# EAGLE design Science-BoardR2 (EAGLE 7.4.0)
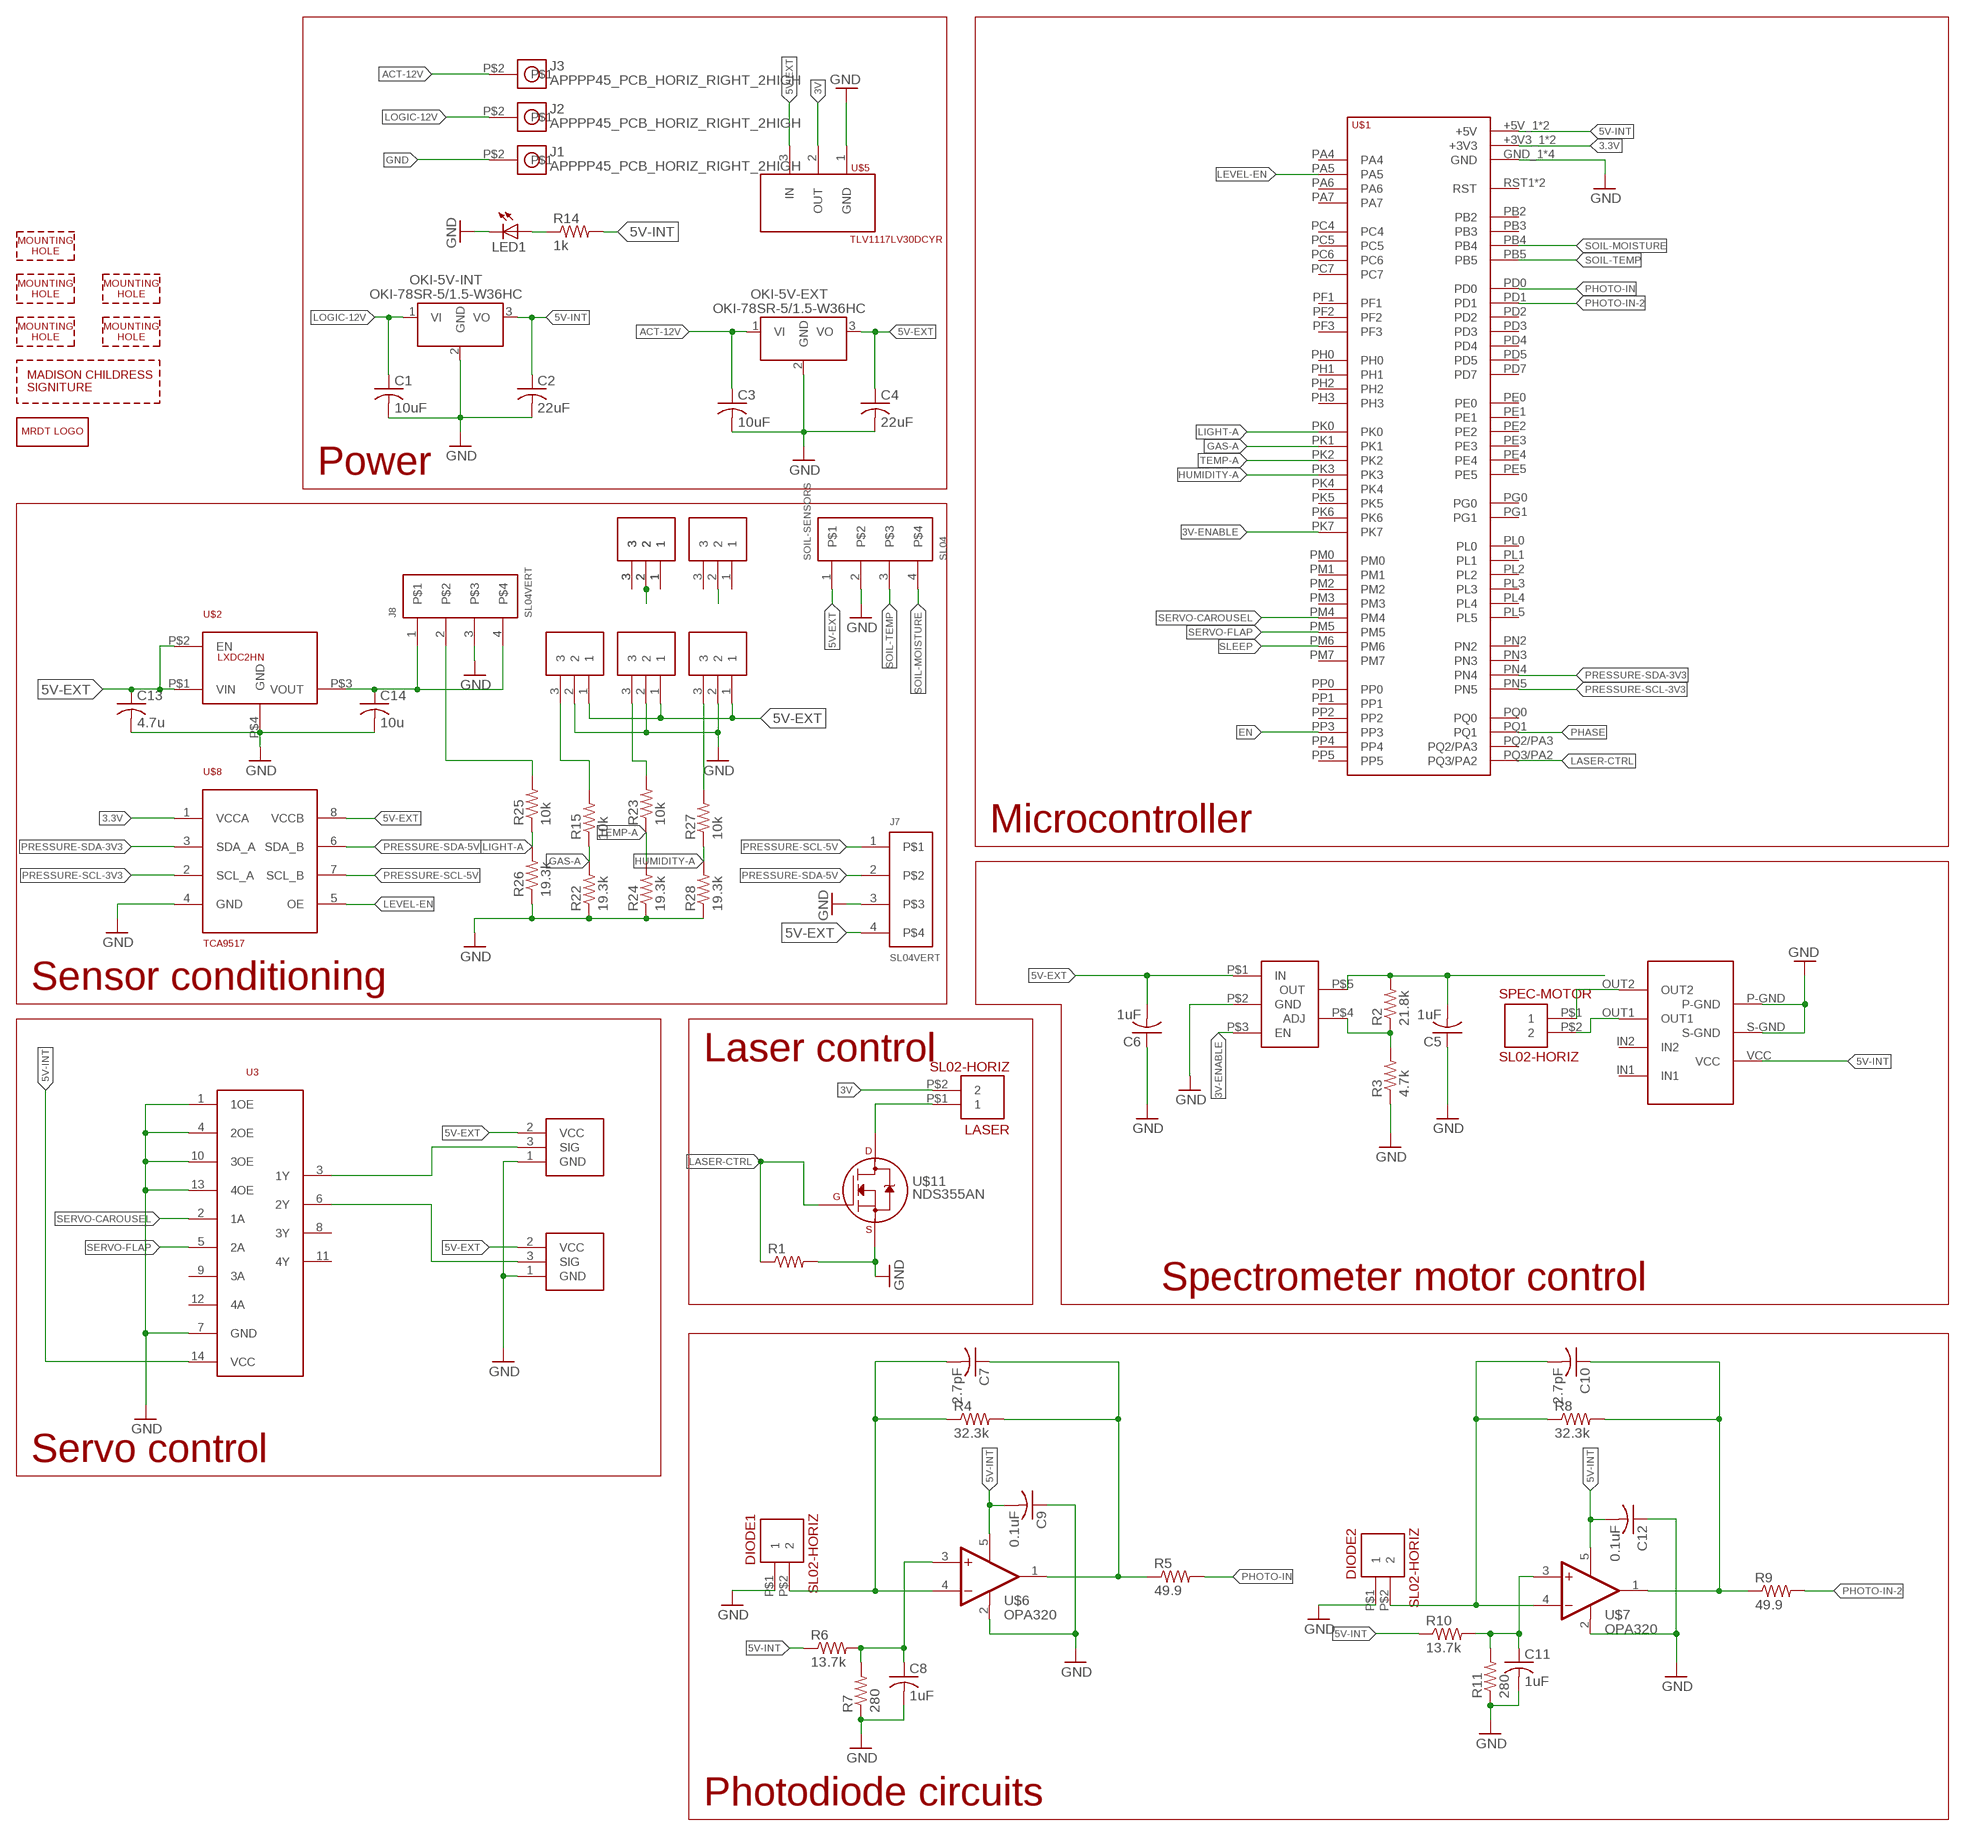
[diagram p0: schematic, sheet 1]

## Parts
C1  10uF  C-USC1206  [C1206]
C2  22uF  C-USC1206  [C1206]
C3  10uF  C-USC1206  [C1206]
C4  22uF  C-USC1206  [C1206]
C5  1uF  C-USC0805  [C0805]
C6  1uF  C-USC0805  [C0805]
C7  2.7pF  C-USC0805  [C0805]
C8  1uF  C-USC0805  [C0805]
C9  0.1uF  C-USC0805  [C0805]
C10  2.7pF  C-USC0805  [C0805]
C11  1uF  C-USC0805  [C0805]
C12  0.1uF  C-USC0805  [C0805]
C13  4.7u  C-USC0805  [C0805]
C14  10u  C-USC0805  [C0805]
CAROUSEL  SERVOMOLEX_SL_THRU_HOLE  [MOLEX_SL_03_TH]
DIODE1  SL02-HORIZ  [MOLEX-70551-0001]
DIODE2  SL02-HORIZ  [MOLEX-70551-0001]
FLAP  SERVOMOLEX_SL_THRU_HOLE  [MOLEX_SL_03_TH]
H1  MOUNTING_HOLE#6  [#6_SCREW]
H2  MOUNTING_HOLE#6  [#6_SCREW]
H3  MOUNTING_HOLE#6  [#6_SCREW]
H4  MOUNTING_HOLE#6  [#6_SCREW]
H5  MOUNTING_HOLE#6  [#6_SCREW]
J1  APPPP45_PCB_HORIZ_RIGHT_2HIGH  [APP45_PCB_HORIZ_RIGHT_2HIGH]
J2  APPPP45_PCB_HORIZ_RIGHT_2HIGH  [APP45_PCB_HORIZ_RIGHT_2HIGH]
J3  APPPP45_PCB_HORIZ_RIGHT_2HIGH  [APP45_PCB_HORIZ_RIGHT_2HIGH]
J4  SL03  [MOLEX-70543-0002]
J5  SL03  [MOLEX-70543-0002]
J6  SL03  [MOLEX-70543-0002]
J7  SL04VERT  [MOLEX-70543-0003]
J8  SL04VERT  [MOLEX-70543-0003]
J9  SL03  [MOLEX-70543-0002]
J10  SL03  [MOLEX-70543-0002]
J11  SL03  [MOLEX-70543-0002]
LASER  SL02-HORIZ  [MOLEX-70551-0001]
LED1  LEDCHIP-LED0805  [CHIP-LED0805]
LOGO1  MRDT_LOGO  [MRDT_LOGO]
OKI-5V-EXT  OKI-78SR-5/1.5-W36HC  [OKI-78SR_HORIZ]
OKI-5V-INT  OKI-78SR-5/1.5-W36HC  [OKI-78SR_HORIZ]
R1  R-US_M0805  [M0805]
R2  21.8k  R-US_M0805  [M0805]
R3  4.7k  R-US_M0805  [M0805]
R4  32.3k  R-US_M0805  [M0805]
R5  49.9  R-US_M0805  [M0805]
R6  13.7k  R-US_M0805  [M0805]
R7  280  R-US_M0805  [M0805]
R8  32.3k  R-US_M0805  [M0805]
R9  49.9  R-US_M0805  [M0805]
R10  13.7k  R-US_M0805  [M0805]
R11  280  R-US_M0805  [M0805]
R14  1k  R-US_M0805  [M0805]
R15  10k  R-US_R0805  [R0805]
R22  19.3k  R-US_R0805  [R0805]
R23  10k  R-US_R0805  [R0805]
R24  19.3k  R-US_R0805  [R0805]
R25  10k  R-US_R0805  [R0805]
R26  19.3k  R-US_R0805  [R0805]
R27  10k  R-US_R0805  [R0805]
R28  19.3k  R-US_R0805  [R0805]
SOIL-SENSORS  SL04  [MOLEX_SL_04_TH]
SPEC-MOTOR  SL02-HORIZ  [MOLEX-70551-0001]
U3  SN74AHCT125  [SOIC14]
U$1  TIVA-1294  [TIVA-C-CONNECTED]
U$2  LXDC2HN  [4-SMD]
U$3  AP7365-WG-7DICT-ND  [SOT-25]
U$5  TLV1117LV30DCYR  [TO-243AA]
U$6  OPA320  [SOT-23-5]
U$7  OPA320  [SOT-23-5]
U$8  TCA9517  [SOIC8]
U$9  MADISON-CHILDRESS  [MADISON-CHLDRESS-SIG]
U$10  LB1930MC  [SOIC10]
U$11  NDS355AN  [SOT-23]

## Nets
3.3V: U$1.+3V3_1(+3V3) U$1.+3V3_2(+3V3) U$8.1(VCCA)
3V: LASER.P$2 U$5.2(OUT)
3V-ENABLE: U$1.PK7 U$3.P$3(EN)
5V-EXT: C4.1 C6.2 C13.1 CAROUSEL.2(VCC) FLAP.2(VCC) J4.1 J5.1 J6.1 J7.4 OKI-5V-EXT.3(VO) SOIL-SENSORS.1 U$2.P$1(VIN) U$2.P$2(EN) U$3.P$1(IN) U$5.3(IN) U$8.8(VCCB)
5V-INT: C2.1 C9.2 C12.2 OKI-5V-INT.3(VO) R6.1 R10.1 R14.2 U3.14(VCC) U$1.+5V_1(+5V) U$1.+5V_2(+5V) U$6.5(OFF1) U$7.5(OFF1) U$10.VCC
ACT-12V: C3.1 J3.P$2 OKI-5V-EXT.1(VI)
EN: U$1.PP3
GAS-A: R15.1 R22.2 U$1.PK1
GND: C1.2 C2.2 C3.2 C4.2 C5.1 C6.1 C8.2 C9.1 C11.2 C12.1 C13.2 C14.2 CAROUSEL.1(GND) DIODE1.P$1 DIODE2.P$1 FLAP.1(GND) J1.P$2 J4.2 J5.2 J6.2 J7.3 J8.3 LED1.C OKI-5V-EXT.2(GND) OKI-5V-INT.2(GND) R1.2 R3.1 R7.1 R11.1 R22.1 R24.1 R26.1 R28.1 SOIL-SENSORS.2 U3.1(1OE) U3.4(2OE) U3.7(GND) U3.10(3OE) U3.13(4OE) U$1.GND_1(GND) U$1.GND_2(GND) U$1.GND_3(GND) U$1.GND_4(GND) U$2.P$4(GND) U$3.P$2(GND) U$5.1(GND) U$6.2(OFF2) U$7.2(OFF2) U$8.4(GND) U$10.P-GND U$10.S-GND U$11.2(S)
HUMIDITY-A: R27.1 R28.2 U$1.PK3
LASER-CTRL: R1.1 U$1.PQ3/PA2 U$11.1(G)
LEVEL-EN: U$1.PA5 U$8.5(OE)
LIGHT-A: R25.1 R26.2 U$1.PK0
LOGIC-12V: C1.1 J2.P$2 OKI-5V-INT.1(VI)
N$1: SPEC-MOTOR.P$1 U$10.OUT2
N$2: SPEC-MOTOR.P$2 U$10.OUT1
N$3: LASER.P$1 U$11.3(D)
N$4: C7.2 DIODE1.P$2 R4.1 U$6.4(-IN)
N$5: C5.2 R2.2 U$3.P$5(OUT)
N$6: J8.2 R25.2
N$7: J5.3 R23.2
N$8: C7.1 R4.2 R5.1 U$6.1(OUT)
N$9: C10.2 DIODE2.P$2 R8.1 U$7.4(-IN)
N$10: C8.1 R6.2 R7.2 U$6.3(+IN)
N$11: CAROUSEL.3(SIG) U3.3(1Y)
N$12: FLAP.3(SIG) U3.6(2Y)
N$13: C10.1 R8.2 R9.1 U$7.1(OUT)
N$14: C11.1 R10.2 R11.2 U$7.3(+IN)
N$16: J9.1 J11.1
N$17: J9.2 J11.2
N$18: R2.1 R3.2 U$3.P$4(ADJ)
N$19: J9.3 J11.3
N$20: LED1.A R14.1
N$21: J4.3 R15.2
N$22: J6.3 R27.2
N$23: J10.2
PHASE: U$1.PQ1
PHOTO-IN: R5.2 U$1.PD0
PHOTO-IN-2: R9.2 U$1.PD1
PRESSURE-SCL-3V3: U$1.PN5 U$8.2(SCL_A)
PRESSURE-SCL-5V: J7.1 U$8.7(SCL_B)
PRESSURE-SDA-3V3: U$1.PN4 U$8.3(SDA_A)
PRESSURE-SDA-5V: J7.2 U$8.6(SDA_B)
SERVO-CAROUSEL: U3.2(1A) U$1.PM4
SERVO-FLAP: U3.5(2A) U$1.PM5
SLEEP: U$1.PM6
SOIL-MOISTURE: SOIL-SENSORS.4 U$1.PB4
SOIL-TEMP: SOIL-SENSORS.3 U$1.PB5
TEMP-A: R23.1 R24.2 U$1.PK2
UV-3.3: C14.1 J8.1 J8.4 U$2.P$3(VOUT)
Unconnected: J10.1 J10.3 U3.8(3Y) U3.9(3A) U3.11(4Y) U3.12(4A) U$1.PA4 U$1.PA6 U$1.PA7 U$1.PB2 U$1.PB3 U$1.PC4 U$1.PC5 U$1.PC6 U$1.PC7 U$1.PD2 U$1.PD3 U$1.PD4 U$1.PD5 U$1.PD7 U$1.PE0 U$1.PE1 U$1.PE2 U$1.PE3 U$1.PE4 U$1.PE5 U$1.PF1 U$1.PF2 U$1.PF3 U$1.PG0 U$1.PG1 U$1.PH0 U$1.PH1 U$1.PH2 U$1.PH3 U$1.PK4 U$1.PK5 U$1.PK6 U$1.PL0 U$1.PL1 U$1.PL2 U$1.PL3 U$1.PL4 U$1.PL5 U$1.PM0 U$1.PM1 U$1.PM2 U$1.PM3 U$1.PM7 U$1.PN2 U$1.PN3 U$1.PP0 U$1.PP1 U$1.PP2 U$1.PP4 U$1.PP5 U$1.PQ0 U$1.PQ2/PA3 U$1.RST1(RST) U$1.RST_2(RST) U$10.IN1 U$10.IN2

## Notes on the sheet
- Power
- Microcontroller
- Sensor conditioning
- Laser control
- Spectrometer motor control
- Servo control
- Photodiode circuits

## Library data of the parts
C1-C14 = rcl:C-US: CAPACITOR, American symbol
CAROUSEL FLAP = MRDT-Connectors:SERVO; ORIENT: HORIZ; PARTNO: 0705550002
DIODE1 DIODE2 LASER SPEC-MOTOR = MRDT-Connectors:SL02
H1-H5 = MRDT-Hardware:MOUNTING_HOLE: Mounting hole for M6 bolt. Standard use mounting hole for: Tiva C Connected - M6 Anderson Powerpole Mounting Wing - M8 Most frame-mounted PCB's - M8
J1-J3 = MRDT-Connectors:APP: http://www.powerwerx.com/anderson-powerpoles/
J4-J6 J9-J11 = MRDT-Connectors:SL03: Molex 3-pin SL connector Locking 3 pin connector with standard header spacing. Backward compatible with standard RC servo connectors.
J7 J8 SOIL-SENSORS = MRDT-Connectors:SL04
LED1 = led:LED: LED OSRAM: - CHIPLED LG R971, LG N971, LY N971, LG Q971, LY Q971, LO R971, LY R971 LH N974, LH R974 LS Q976, LO Q976, LY Q976 LO Q996 - Hyper CHIPLED LW Q18S LB Q993, LB Q99A, LB R99A - SideLED LS A670, LO A670, LY A670, LG A670, LP A670 LB A673, LV A673, LT A673, LW A673 LH A674 LY A675 LS A676, LA A676, LO A676, LY A676, LW A676 LS A679, LY A679, LG A679 - Hyper Micro SIDELED® LS Y876, LA Y876, LO Y876, LY Y876 LT Y87S - SmartLED LW L88C, LW L88S LB L89C, LB L89S, LG L890 LS L89K, LO L89K, LY L89K LS L896, LA L896, LO L896, LY L896 - TOPLED LS T670, LO T670, LY T670, LG T670, LP T670 LSG T670, LSP T670, LSY T670, LOP T670, LYG T670 LG T671, LOG T671, LSG T671 LB T673, LV T673, LT T673, LW T673 LH T674 LS T676, LA T676, LO T676, LY T676, LB T676, LH T676, LSB T676, LW T676 LB T67C, LV T67C, LT T67C, LS T67K, LO T67K, LY T67K, LW E67C LS E67B, LA E67B, LO E67B, LY E67B, LB E67C, LV E67C, LT E67C LW T67C LS T679, LY T679, LG T679 LS T770, LO T770, LY T770, LG T770, LP T770 LB T773, LV T773, LT T773, LW T773 LH T774 LS E675, LA E675, LY E675, LS T675 LS T776, LA T776, LO T776, LY T776, LB T776 LHGB T686 LT T68C, LB T68C - Hyper Mini TOPLED® LB M676 - Mini TOPLED Santana® LG M470 LS M47K, LO M47K, LY M47K Source: http://www.osram.convergy.de LUXEON: - LUMILED® LXK2-PW12-R00, LXK2-PW12-S00, LXK2-PW14-U00, LXK2-PW14-V00 LXK2-PM12-R00, LXK2-PM12-S00, LXK2-PM14-U00 LXK2-PE12-Q00, LXK2-PE12-R00, LXK2-PE12-S00, LXK2-PE14-T00, LXK2-PE14-U00 LXK2-PB12-K00, LXK2-PB12-L00, LXK2-PB12-M00, LXK2-PB14-N00, LXK2-PB14-P00, LXK2-PB14-Q00 LXK2-PR12-L00, LXK2-PR12-M00, LXK2-PR14-Q00, LXK2-PR14-R00 LXK2-PD12-Q00, LXK2-PD12-R00, LXK2-PD12-S00 LXK2-PH12-R00, LXK2-PH12-S00 LXK2-PL12-P00, LXK2-PL12-Q00, LXK2-PL12-R00 Source: www.luxeon.com KINGBRIGHT: KA-3528ASYC Source: www.kingbright.com
LOGO1 = MRDT-Hardware:MRDT_LOGO
OKI-5V-EXT OKI-5V-INT = MRDT-ICs:OKI-78SR-*/1.5-W36?C: 4.95W DC/DC Converter Manufacturer: Murata; VOUT: +5v
R1-R11 R14 R15 R22-R28 = rcl:R-US_: RESISTOR, American symbol
U3 = MRDT-ICs:SN74AHCT125: part # SN74AHCT125 QUADRUPLE BUS BUFFER GATES WITH 3-STATE OUTPUTS http://www.digikey.com/product-detail/en/SN74AHCT125DR/296-4652-1-ND/405208; PARTNO: SN74AHCT125
U$1 = MRDT-Microcontrollers:TIVA-1294: TIVA C CONNECTED LAUNCHPAD
U$2 = MRDT-ICs:LXDC2HN
U$3 = MRDT-ICs:AP7365-WG-7DICT-ND: Linear Voltage Regulator IC Positive Adjustable 1 Output 0.8 V ~ 5 V 600mA SOT-25-5
U$5 = MRDT-ICs:TLV1117LV30DCYR: Linear Voltage Regulator IC Positive Fixed 1 Output 3V 1A SOT-223-4
U$6 U$7 = MRDT-ICs:OPA320
U$8 = MRDT-ICs:TCA9517: TCA9517 Level-Shifting I2C Bus Repeater
U$9 = sig:MADISON-CHILDRESS
U$10 = Custom:LB1930MC
U$11 = transistors:NDS355AN

## Board
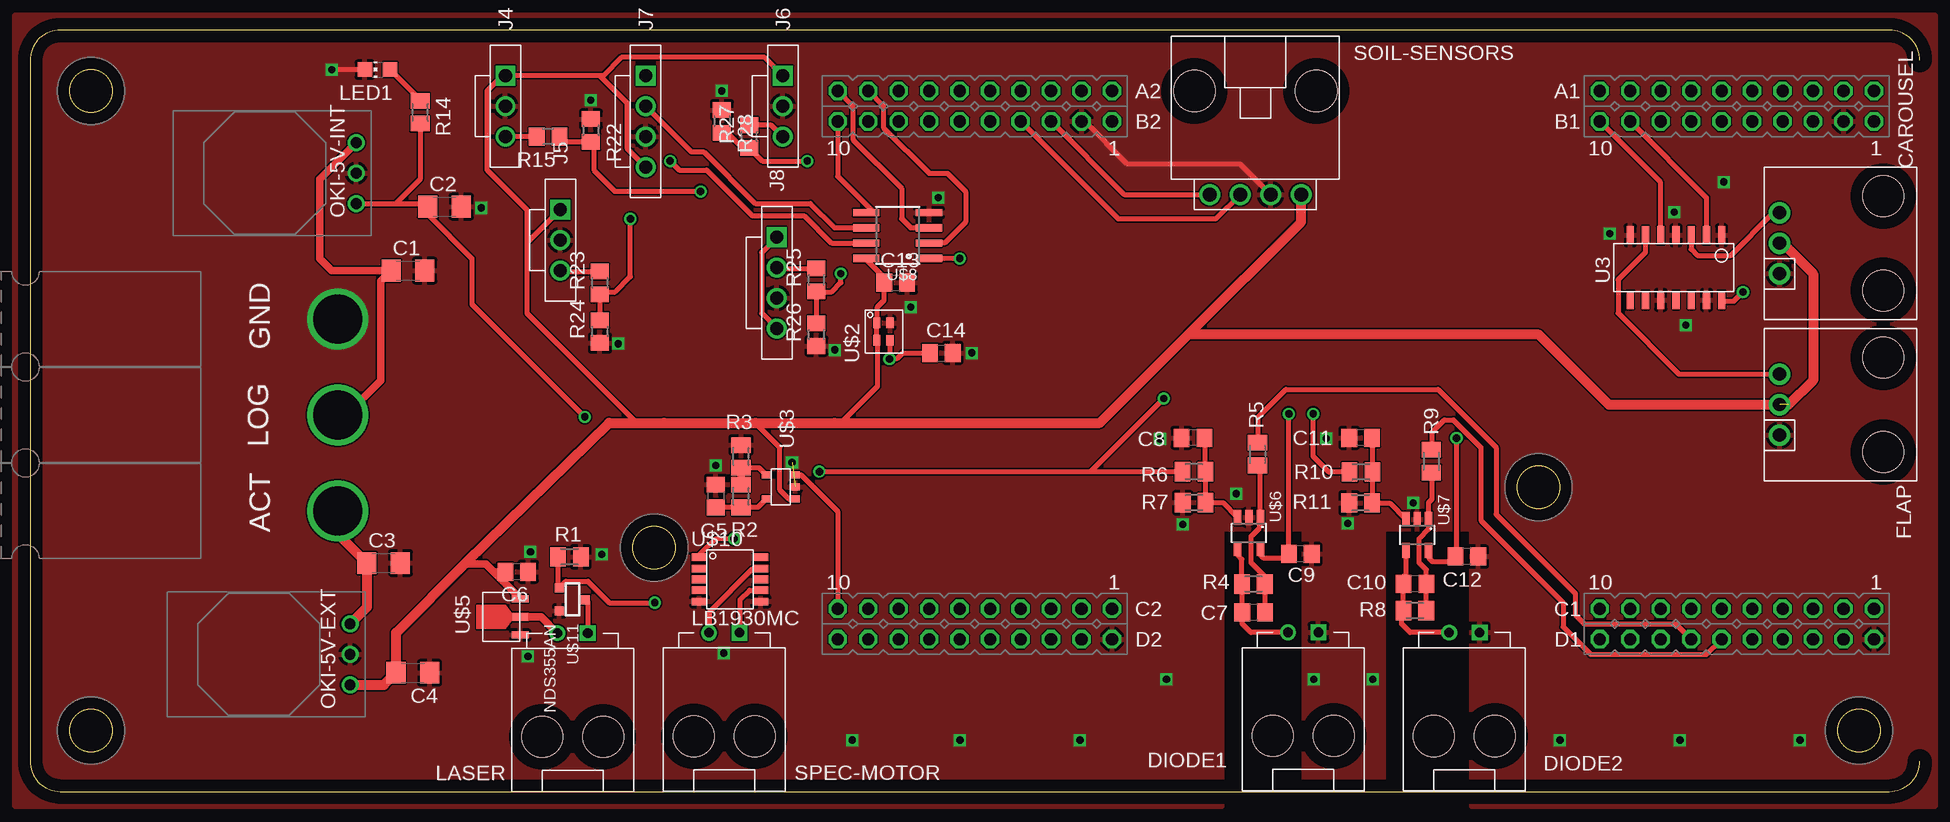
[diagram p1: board, top side]
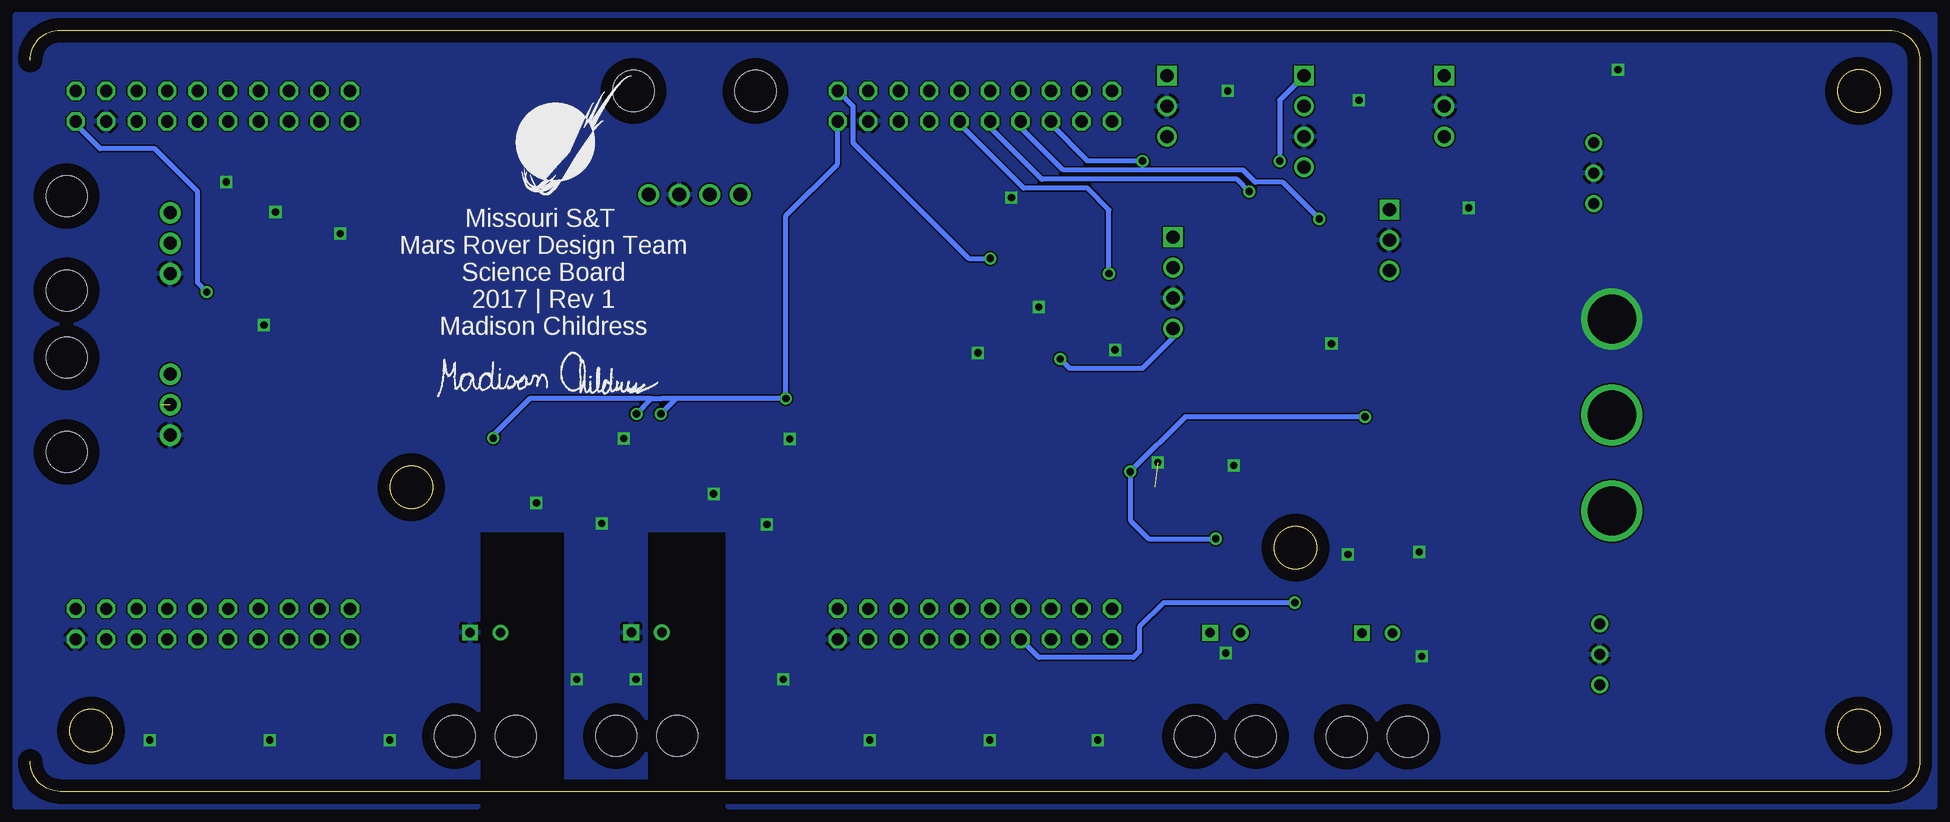
[diagram p2: board, bottom side, seen from below]

Size 157.48 x 63.5 mm. Coordinates in mm from the lower left corner, seen from the top.
Outline: 157.48,2.54 arc-90 154.94,0 2.54,0 arc-90 0,2.54 0,60.96 arc-90 2.54,63.5 154.94,63.5 arc-90 157.48,60.96
Copper layers (1*16): Top 0.035mm / dielectric 1.5mm / Bottom 0.035mm
Design rules "advanced_circuits_standard": minimum track width 5mil, minimum drill 10mil, track to track 5mil, track to pad 5mil, pad to pad 5mil, via to via 5mil, smd to smd 5mil, copper to edge 40mil, drill to drill 5mil, minimum pad ring 10mil, minimum via ring 8mil, stop-mask expansion 4mil, vias tented up to drill 0mil, thermal gap 10mil

### Footprints (pad centres in the part's own frame; a part is rotated, then mirrored left to right if it is on the bottom)
C1206 = smd 1.6 x 1.8: 1 -1.4,0; 2 1.4,0
C0805 = smd 1.3 x 1.5: 1 -0.95,0; 2 0.95,0
MOLEX_SL_03_TH = drill 1.092 pad 1.778: 1 2.54,0; 2 0,0; 3 -2.54,0 | hole 3.404: -3.937,8.636; 3.937,8.636
MOLEX-70551-0001 = drill 0.8 square: P$1 -1.27,0 | drill 0.8: P$2 1.27,0 | hole 3.404: 2.54,8.636; -2.54,8.636
APP45_PCB_HORIZ_RIGHT_2HIGH = drill 4.064: P$2 36.068,3.969
MOLEX-70543-0002 = drill 1.1 square: 1 2.54,0 | drill 1.1: 2 0,0; 3 -2.54,0
MOLEX-70543-0003 = drill 1.1 square: 1 3.81,0 | drill 1.1: 2 1.27,0; 3 -1.27,0; 4 -3.81,0
CHIP-LED0805 = smd 1.2 x 1.2: A 0,-1.05; C 0,1.05
OKI-78SR_HORIZ = drill 0.9 pad 1.422: 1 0,0; 2 -2.54,0; 3 -5.08,0
SOT23 = smd 1 x 1.4: 1 -0.95,-1.1; 2 0.95,-1.1; 3 0,1.1
M0805 = smd 1.3 x 1.6: 1 -0.95,0; 2 0.95,0
R0805 = smd 1.3 x 1.5: 1 -0.95,0; 2 0.95,0
MOLEX_SL_04_TH = drill 1.168: 1 3.81,0; 2 1.27,0; 3 -1.27,0; 4 -3.81,0 | hole 3.454: -5.08,8.636; 5.08,8.636
SOIC14 = smd 1.5 x 0.6: 1 1.11,10.16; 2 1.11,8.89; 3 1.11,7.62; 4 1.11,6.35; 5 1.11,5.08; 6 1.11,3.81; 7 1.11,2.54; 8 6.51,2.54; 9 6.51,3.81; 10 6.51,5.08; 11 6.51,6.35; 12 6.51,7.62; 13 6.51,8.89; 14 6.51,10.16
TIVA-C-CONNECTED = drill 1.016 octagon: +3V3_1 59.69,54.61; +3V3_2 123.19,54.61; +5V_1 59.69,52.07; +5V_2 123.19,52.07; GND_1 57.15,52.07; GND_2 59.69,8.89; GND_3 120.65,52.07; GND_4 123.19,8.89; PA4 39.37,52.07; PA5 36.83,52.07; PA6 105.41,52.07; PA7 52.07,8.89; PB2 102.87,54.61; PB3 100.33,54.61; PB4 54.61,52.07; PB5 52.07,52.07; PC4 118.11,54.61; PC5 115.57,54.61; PC6 113.03,54.61; PC7 105.41,54.61; PD0 107.95,8.89; PD1 110.49,8.89; PD2 57.15,54.61; PD3 107.95,54.61; PD4 49.53,54.61; PD5 46.99,54.61; PD7 107.95,52.07; PE0 118.11,52.07; PE1 115.57,52.07; PE2 113.03,52.07; PE3 110.49,52.07; PE4 120.65,54.61; PE5 110.49,54.61; PF1 123.19,11.43; PF2 120.65,11.43; PF3 118.11,11.43; PG0 115.57,11.43; PG1 59.69,11.43; PH0 44.45,11.43; PH1 41.91,11.43; PH2 118.11,8.89; PH3 115.57,8.89; PK0 49.53,52.07; PK1 46.99,52.07; PK2 44.45,52.07; PK3 41.91,52.07; PK4 57.15,11.43; PK5 54.61,11.43; PK6 39.37,11.43; PK7 36.83,11.43; PL0 107.95,11.43; PL1 105.41,11.43; PL2 102.87,11.43; PL3 100.33,11.43; PL4 113.03,11.43; PL5 110.49,11.43; PM0 52.07,11.43; PM1 49.53,11.43; PM2 46.99,11.43; PM3 120.65,8.89; PM4 102.87,52.07; PM5 100.33,52.07; PM6 36.83,8.89; PM7 57.15,8.89; PN2 105.41,8.89; PN3 102.87,8.89; PN4 36.83,54.61; PN5 39.37,54.61; PP0 54.61,54.61; PP1 52.07,54.61; PP2 100.33,8.89; PP3 41.91,8.89; PP4 41.91,54.61; PP5 54.61,8.89; PQ0 44.45,54.61; PQ1 39.37,8.89; PQ2/PA3 46.99,8.89; PQ3/PA2 44.45,8.89; RST1 49.53,8.89; RST_2 113.03,8.89
4-SMD = smd 0.85 x 0.6: P$1 0.725,0.55; P$2 -0.725,0.55; P$3 -0.725,-0.55; P$4 0.725,-0.55
SOT-25 = smd 0.55 x 0.8: P$1 1,1.2; P$2 0,1.2; P$3 -1,1.2; P$4 -1,-1.2; P$5 1,-1.2
TO-243AA = smd 0.57 x 1.4: 1 -1.5,0.7; 3 1.5,0.7 | smd 0.635 x 1.27: 2 0,0.7
SOT-23-5 = smd 0.62 x 1.22: 1 -0.95,-1.3; 2 0,-1.3; 3 0.95,-1.3; 4 0.95,1.3; 5 -0.95,1.3
SOIC8 = smd 0.6 x 2.2: 1 0.457,-0.813; 2 1.727,-0.813; 3 2.997,-0.813; 4 4.267,-0.813; 5 4.267,4.419; 6 2.997,4.419; 7 1.727,4.419; 8 0.457,4.419
SOIC10 = smd 1.27 x 0.635: IN1 -0.6,2.45; IN2 -0.6,1.55; NC1 4.5,4.3; NC2 -0.6,3.35; NC3 4.5,2.45; OUT1 4.5,3.35; OUT2 4.5,1.55; P-GND 4.5,0.6; S-GND -0.6,0.6; VCC -0.6,4.3
SOT-23 = smd 0.762 x 0.762: 1 -0.979,-1.101; 2 0.94,-1.101; 3 0.025,1.067

### Placement (x,y rotation side)
C1  31.5,43.43 0 top
C2  34.54,48.77 0 top
C3  29.46,19.05 0 top
C4  31.9,9.91 0 top
C5  57.15,24.64 270 top
C6  40.56,18.31 180 top
C7  101.97,14.92 180 top
C8  96.91,29.5 180 top
C9  105.86,19.8 180 top
C10  115.41,17.32 180 top
C11  110.89,29.49 180 top
C12  119.74,19.6 180 top
C13  72.14,42.42 0 top
C14  75.95,36.58 0 top
CAROUSEL  145.8,45.72 270 top
DIODE1  106.1,13.27 180 top
DIODE2  119.53,13.26 180 top
FLAP  145.8,32.26 270 top
H1  5.08,5.08 0 top
H2  152.4,5.08 0 top
H3  5.08,58.42 0 top
H4  125.7,25.37 0 top
H5  52.02,20.32 90 top
J1  -10.41,35.43 0 top
J2  -10.41,27.43 0 top
J3  -10.41,19.43 0 top
J4  39.62,57.15 90 top
J5  44.2,45.97 90 top
J6  62.74,57.15 90 top
J7  51.31,55.88 90 top
J8  62.23,42.42 90 top
J9  -15.49,-8.64 0 top  (outside the outline)
J10  -15.49,-12.7 0 top  (outside the outline)
J11  -15.49,-16.76 0 top  (outside the outline)
LASER  45.21,13.21 180 top
LED1  28.96,60.2 90 top
LOGO1  117,48.88 0 bottom
OKI-5V-EXT  26.67,13.97 90 top
OKI-5V-INT  27.18,54.1 90 top
Q1  BSS123  [SOT23]  -18.29,-2.03 0 top  (outside the outline)
R1  44.96,19.56 0 top
R2  59.26,24.64 270 top
R3  59.26,27.94 270 top
R4  101.94,17.29 0 top
R5  102.28,28.14 90 top
R6  96.99,26.66 0 top
R7  97.01,24.08 0 top
R8  115.41,15.09 0 top
R9  116.77,27.54 90 top
R10  110.92,26.64 0 top
R11  110.89,24.06 0 top
R14  32.51,56.64 270 top
R15  43.18,54.61 180 top
R22  46.74,55.12 270 top
R23  47.5,42.42 90 top
R24  47.5,38.35 90 top
R25  65.53,42.67 90 top
R26  65.53,38.1 90 top
R27  59.94,54.61 90 top
R28  57.66,55.88 270 top
SOIL-SENSORS  102.11,49.78 0 top
SPEC-MOTOR  57.86,13.23 180 top
U3  130.81,47.5 270 top
U$1  30.48,3.81 0 top
U$2  71.12,38.35 90 top
U$3  62.56,25.4 270 top
U$5  41.55,14.55 90 top
U$6  101.57,21.56 180 top
U$7  115.6,21.41 180 top
U$8  74.11,44.01 90 top
U$9  124.62,32.02 0 bottom
U$10  56.39,15.24 0 top
U$11  45.21,16 270 top

### Tracks (layer width: path | path; a pad name or v marks a point on that pad's centre or on a via)
3.3V  (via drill 0.6)
  Top 0.406: v77.47,44.45 75.69,44.45 75.68,44.46 U$8.1
  Bottom 0.406: U$1.+3V3_1 88.9,57.15 88.9,54.1 79.25,44.45 v77.47,44.45
3V
  Top 0.61: U$5.2 42.6,14.55 LASER.P$2
3V-ENABLE
  Top 0.406: U$3.P$3 63.78,26.42 64.26,26.42 67.31,23.37 U$1.PK7
5V-EXT  (1 unrouted)
  Top 0.406: U$3.P$1 63.74,24.38 63.25,24.38 62.48,25.15 62.48,28.7 60.45,30.73 | U$8.8 69.69,44.36 71.12,42.93 71.12,42.48 C13.1 71.19,40.96 70.61,40.39 70.61,39.12 U$2.P$1 U$2.P$2 70.61,37.63 70.61,33.78 67.56,30.73 67.06,30.73 | J6.1 61.21,61.21 49.28,61.21 47.75,59.69 47.5,59.69 | J7.4 49.78,53.59 49.78,57.4 47.5,59.69 | 47.5,59.69 J4.1 39.37,59.69 38.1,58.42 38.1,51.82 41.4,48.51 41.4,45.97 | 41.4,45.97 41.4,39.88 50.55,30.73 52.83,30.73 | J5.1 41.66,45.97 41.4,45.97
  Top 0.61: U$5.3 40.85,16.12 38.66,18.31 | 38.66,18.31 38,18.97 36.47,18.97 36.36,19.09 | C6.2 38.66,18.31
  Top 0.813: 96.52,38.1 89.15,30.73 67.06,30.73 60.45,30.73 52.83,30.73 48.26,30.73 36.36,19.09 30.5,13.23 C4.1 29.49,8.89 OKI-5V-EXT.3 | 96.52,38.1 125.73,38.1 131.57,32.26 146.56,32.26 148.59,34.29 148.59,43.18 146.05,45.72 CAROUSEL.2 | 96.52,38.1 105.92,47.5 SOIL-SENSORS.1
5V-INT  (via drill 0.6)
  Top 0.406: U$7.5 116.55,19.5 116.87,19.18 118.7,19.18 C12.2 118.87,19.94 v118.87,29.46 | U$6.5 102.52,19.73 102.77,19.48 104.59,19.48 C9.2 v104.91,31.49 | v65.79,26.67 88.39,26.67 | 88.39,26.67 94.75,26.67 94.75,26.66 R6.1 | R10.1 108.23,26.64 106.93,27.94 v106.93,31.5 | OKI-5V-INT.3 30.48,49.02 | 30.48,49.02 32.89,49.02 C2.1 33.14,48.14 36.83,44.45 36.83,40.64 v46.23,31.24 | R14.2 32.51,51.05 30.48,49.02 | 88.39,26.67 v94.49,32.77 | 140.97,40.64 U3.14 141.06,40.89 141.99,40.89 v142.75,41.66 | v58.67,21.08 57.15,21.08 55.79,19.72 U$10.VCC
  Bottom 0.406: v46.23,31.24 61.21,31.24 v65.79,26.67 65.79,22.61 64.26,21.08 v58.67,21.08 | U$1.+5V_1 90.17,52.32 94.49,48.01 v94.49,32.77 103.63,32.77 | v142.75,41.66 143.51,42.42 143.51,50.04 147.07,53.59 151.64,53.59 153.67,55.63 U$1.+5V_2 | 103.63,32.77 104.9,32.77 105.66,32.77 | 105.66,32.77 115.82,32.77 118.87,29.72 v118.87,29.46 | v104.91,31.49 103.63,32.77 | v106.93,31.5 105.66,32.77
ACT-12V
  Top 0.813: J3.P$2 25.65,21.46 C3.1 28.06,15.36 OKI-5V-EXT.1
GAS-A  (via drill 0.6)
  Top 0.406: v55.88,50.04 48.77,50.04 46.99,51.82 46.99,53.91 R22.2 44.57,54.17 R15.1
  Bottom 0.406: v55.88,50.04 56.9,51.05 73.15,51.05 77.47,55.37 U$1.PK1
GND  (via drill 0.6)  (1 unrouted)
  Top 0.406: LED1.C v25.15,60.2 | SOIL-SENSORS.2 100.84,52.32 91.44,52.32 87.88,55.88 U$1.GND_1
  other vias: 37.6,48.66 63.5,27.43 47.65,19.78 41.7,19.98 41.49,11.27 68.51,4.29 77.49,4.29 87.49,4.29 94.7,9.37 106.99,9.37 111.91,9.37 127.49,4.29 137.49,4.29 147.49,4.29 108.01,29.43 115.28,24.07 100.51,24.83 109.82,22.35 96.07,22.28 57.82,11.54 57.16,27.19 94.16,29.4 137.98,38.89 131.63,46.51 137.02,48.32 141.13,50.83 73.41,40.39 75.69,49.53 49.02,37.34 78.49,36.58 67.06,36.83 46.74,57.66 57.66,58.42
  pour Top: -1.27,64.77 158.75,64.77 158.75,-1.27 120.14,-1.27 120.14,21.59 120.14,21.84 112.78,21.84 112.78,21.59 112.78,-1.27 106.17,-1.27 106.17,21.84 99.31,21.84 99.31,-1.27 -1.27,-1.27
  pour Bottom: -1.27,64.77 158.75,64.77 158.75,-1.27 120.14,-1.27 120.14,21.84 112.78,21.84 112.78,-1.27 106.17,-1.27 106.17,21.84 99.31,21.84 99.31,-1.27 -1.27,-1.27
HUMIDITY-A  (via drill 0.6)
  Top 0.406: v64.77,52.58 61.03,52.58 R27.1 59.88,53.59 59.44,53.59 58.1,54.93 R28.2
  Bottom 0.406: v64.77,52.58 69.34,52.58 72.39,55.63 U$1.PK3
LASER-CTRL  (via drill 0.6)
  Top 0.406: R1.1 44.01,17.08 U$11.1 44.66,17.53 46.48,17.53 48.26,15.75 v52.07,15.75
  Bottom 0.406: v52.07,15.75 62.99,15.75 65.02,13.72 65.02,11.68 65.53,11.18 73.41,11.18 U$1.PQ3/PA2
LEVEL-EN
  Top 0.406: U$1.PA5 67.31,51.31 70.36,48.26 U$8.5
LIGHT-A  (via drill 0.6)
  Top 0.406: R26.2 R25.1 65.6,41.66 66.8,41.66 67.56,42.42 v67.56,43.18
  Bottom 0.406: v67.56,43.18 67.56,48.51 69.34,50.29 74.68,50.29 80.01,55.63 U$1.PK0
LOGIC-12V
  Top 0.61: J2.P$2 26.32,31.4 29.21,34.29 29.21,42.55 C1.1 25.15,43.43 24.13,44.45 24.13,51.05 OKI-5V-INT.1
N$1
  Top 0.406: SPEC-MOTOR.P$1 59.18,13.28 59.18,16 59.97,16.79 U$10.OUT2
N$2
  Top 0.406: U$10.OUT1 60.84,18.54 60.2,18.54 56.59,14.94 SPEC-MOTOR.P$2
N$3
  Top 0.406: U$11.3 46.48,15.77 LASER.P$1
N$4
  Top 0.406: U$6.4 100.67,20.22 100.67,19.68 100.99,19.36 R4.1 101.02,17.26 C7.2 101.02,13.99 101.74,13.27 DIODE1.P$2
N$5
  Top 0.406: C5.2 R2.2 60.65,23.69 U$3.P$5
N$6
  Top 0.406: J8.2 62.3,43.62 R25.2
N$7
  Top 0.406: J5.3 44.26,43.37 R23.2
N$8
  Top 0.406: C7.1 102.92,17.26 R4.2 102.89,17.96 101.77,19.08 101.77,21.28 102.47,21.98 102.47,22.8 U$6.1 102.52,26.95 R5.1
N$9
  Top 0.406: 114.46,17.92 R8.1 114.3,14.93 114.3,13.97 115.01,13.26 DIODE2.P$2 | 114.46,17.92 C10.2 | U$7.4 114.65,18.12 114.46,17.92
N$10
  Top 0.406: C8.1 97.94,29.41 R6.2 97.96,26.64 R7.2 99.4,24.08 U$6.3
N$11
  Top 0.406: U3.3 138.43,45.21 138.94,44.7 141.73,44.7 145.29,48.26 CAROUSEL.3
N$12
  Top 0.406: U3.6 134.62,44.96 132.33,42.67 132.33,39.88 137.41,34.8 FLAP.3
N$13
  Top 0.406: R8.2 116.36,17.92 C10.1 116.36,18.49 115.77,19.08 115.77,21.08 116.57,21.88 116.57,22.69 U$7.1 116.55,24.1 116.84,24.38 116.84,26.52
  Top 0.61: 116.84,26.52 R9.1
N$14
  Top 0.406: C11.1 111.84,26.68 R10.2 111.87,24.09 R11.2 113.3,24.06 U$7.3
N$15  (via drill 0.6)
  other vias: 104.9,31.5
N$16  (1 unrouted)
N$17  (1 unrouted)
N$18
  Top 0.406: U$3.P$4 60.77,26.99 R3.2
  Top 0.61: R2.1 R3.2
N$19  (1 unrouted)
N$20
  Top 0.406: R14.1 32.51,57.69 LED1.A
N$21
  Top 0.406: R15.2 J4.3
N$22
  Top 0.406: J6.3 61.79,55.56 R27.2
PHOTO-IN
  Top 0.406: R5.2 102.36,29.17 102.36,31.24 104.65,33.53 117.35,33.53 122.17,28.7 122.17,23.11 128.78,16.51 128.78,14.73 129.54,13.97 137.16,13.97 U$1.PD0
PHOTO-IN-2
  Top 0.406: R9.2 116.84,28.56 116.84,29.97 117.86,30.99 118.62,30.99 120.9,28.7 120.9,22.61 127.76,15.75 127.76,13.72 130.05,11.43 139.7,11.43 U$1.PD1
PRESSURE-SCL-3V3
  Top 0.406: U$1.PN5 71.12,57.15 71.12,55.37 74.93,51.56 76.45,51.56 77.98,50.04 77.98,47.5 76.21,45.73 U$8.2
PRESSURE-SCL-5V  (via drill 0.6)
  Top 0.406: v53.34,52.58 54.1,51.82 56.39,51.82 60.2,48.01 64.52,48.01 66.79,45.73 U$8.7
  Bottom 0.406: J7.1 53.34,57.66 v53.34,52.58
PRESSURE-SDA-3V3
  Top 0.406: U$1.PN4 68.58,57.15 68.58,54.36 72.64,50.29 72.64,47.75 73.39,47 U$8.3
PRESSURE-SDA-5V
  Top 0.406: J7.2 55.12,53.34 56.13,53.34 60.45,49.02 65.02,49.02 67.04,47 U$8.6
SERVO-CAROUSEL
  Top 0.406: U$1.PM4 139.7,49.53 U3.2
SERVO-FLAP
  Top 0.406: U3.5 135.89,50.8 U$1.PM5
SOIL-MOISTURE
  Top 0.406: U$1.PB4 91.19,49.78 SOIL-SENSORS.4
SOIL-TEMP
  Top 0.406: U$1.PB5 90.68,47.75 98.81,47.75 SOIL-SENSORS.3
TEMP-A  (via drill 0.6)
  Top 0.406: R24.2 R23.1 47.69,41.66 48.77,41.66 50.04,42.93 v50.04,47.75
  Bottom 0.406: v50.04,47.75 53.09,50.8 55.37,50.8 56.39,51.82 71.37,51.82 74.93,55.37 U$1.PK2
UV-3.3  (via drill 0.6)
  Top 0.406: C14.1 72.72,36.58 72.22,36.07 v71.63,36.07 71.63,37.59 U$2.P$3 | J8.1 60.96,44.96 60.96,39.88 J8.4
  Bottom 0.406: v71.63,36.07 70.87,35.31 64.77,35.31 62.23,37.85 J8.4

### Text on the board
tNames: GND | LOG | ACT
bNames: Missouri S&T / Mars Rover Design Team / Science Board / 2017 | Rev 1 / Madison Childress